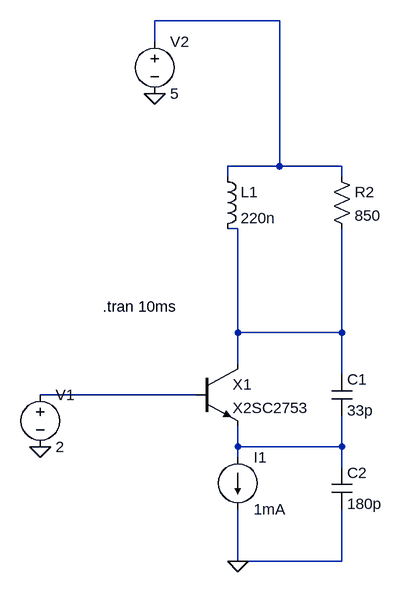
[diagram p0: schematic oscillator.asc]
oscillator.asc, the LTspice schematic file:
Version 4
SHEET 1 1204 680
WIRE 576 -304 384 -304
WIRE 384 -272 384 -304
WIRE 576 -80 576 -304
WIRE 576 -80 496 -80
WIRE 672 -80 576 -80
WIRE 496 -64 496 -80
WIRE 672 -64 672 -80
WIRE 512 16 496 16
WIRE 512 176 512 16
WIRE 672 176 672 16
WIRE 672 176 512 176
WIRE 512 224 512 176
WIRE 672 240 672 176
WIRE 448 272 208 272
WIRE 512 352 512 320
WIRE 672 352 672 304
WIRE 672 352 512 352
WIRE 512 368 512 352
WIRE 672 384 672 352
WIRE 512 528 512 448
WIRE 672 528 672 448
WIRE 672 528 512 528
FLAG 512 528 0
FLAG 384 -192 0
FLAG 208 352 0
SYMBOL npn 448 224 R0
SYMATTR InstName X1
SYMATTR Value X2SC2753
SYMATTR Prefix X
SYMBOL Cap 656 240 R0
SYMATTR InstName C1
SYMATTR Value 33p
SYMBOL Res 656 -80 R0
SYMATTR InstName R2
SYMATTR Value 850
SYMBOL ind 480 -80 R0
SYMATTR InstName L1
SYMATTR Value 220n
SYMBOL Cap 656 384 R0
SYMATTR InstName C2
SYMATTR Value 180p
SYMBOL current 512 368 R0
SYMATTR InstName I1
SYMATTR Value 1mA
SYMBOL voltage 208 256 R0
SYMATTR InstName V1
SYMATTR Value 2
SYMBOL voltage 384 -288 R0
SYMATTR InstName V2
SYMATTR Value 5
TEXT 304 136 Left 2 !.tran 10ms

The netlist it stands for:
* oscillator.asc
XX1 N002 N003 N004 X2SC2753  ; pins C B E
C1 N002 N004 33p
R2 N001 N002 850
L1 N001 N002 220n
C2 N004 0 180p
I1 N004 0 1mA
V1 N003 0 2
V2 N001 0 5
.tran 10ms
.backanno
.end